# Altium schematic sheet Target.SchDoc: Sniffer
size A4; DocumentNumber: 5; SheetNumber: 5; SheetTotal: 5
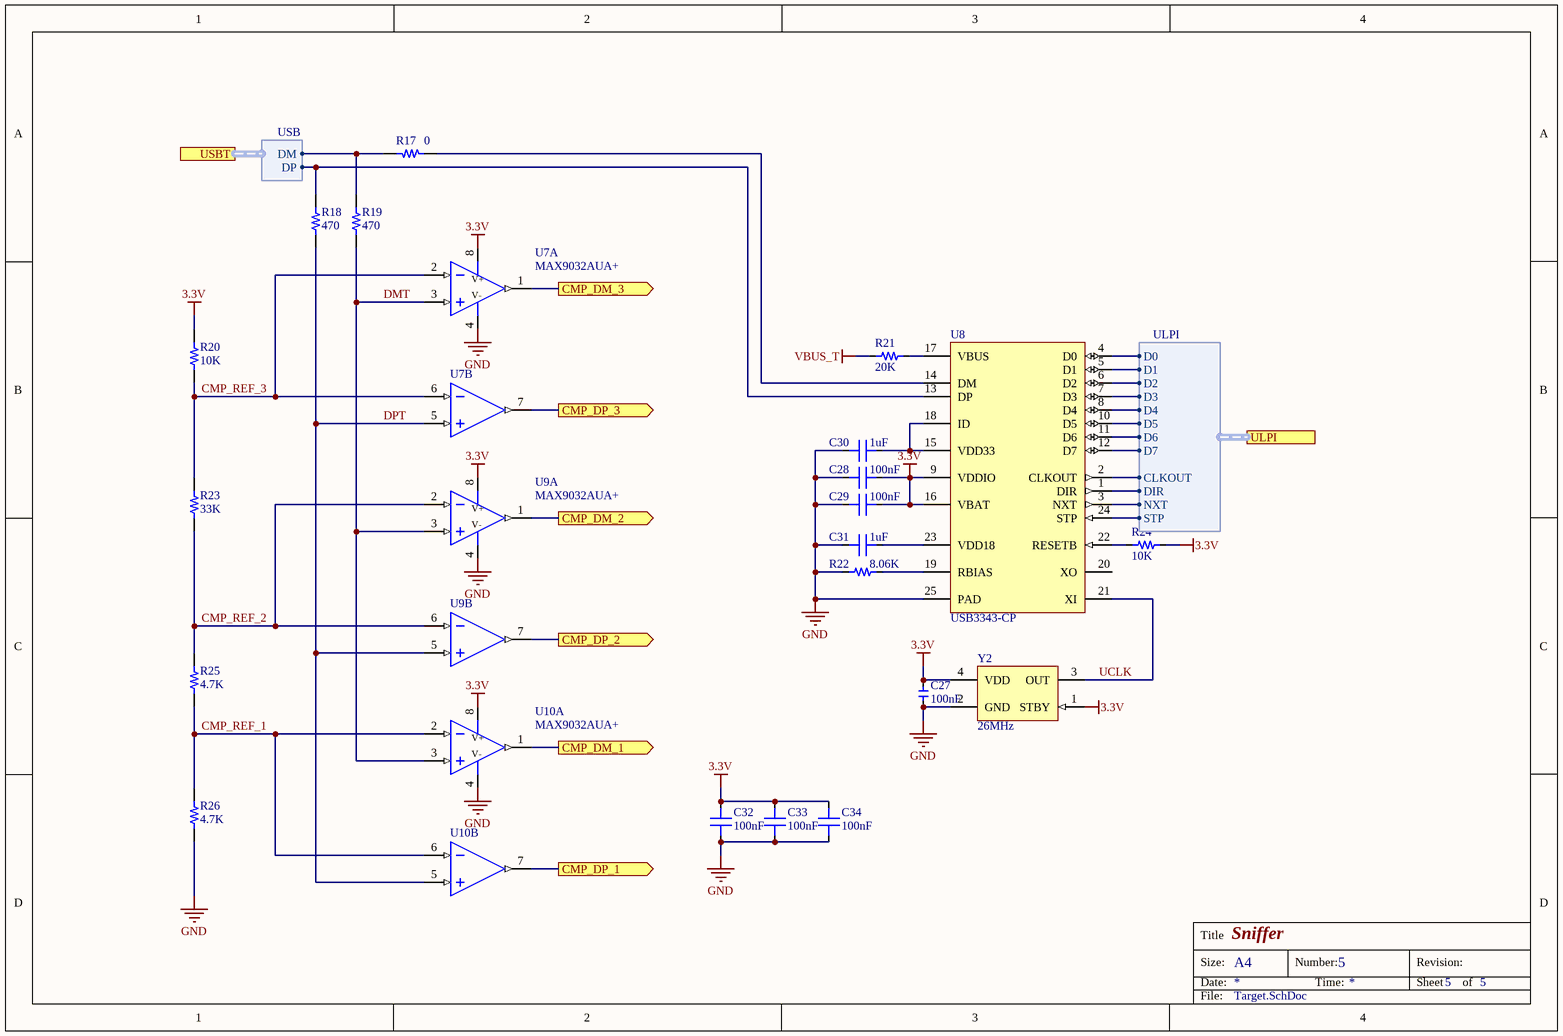
[diagram p0: Target.SchDoc]

## Parts
C27  100nF  [CAP 0402/1005]
C28  100nF  [CAP 0402/1005]
C29  100nF  [CAP 0402/1005]
C30  1uF  [CAP 0402/1005]
C31  1uF  [CAP 0402/1005]
C32  100nF  [CAP 0402/1005]
C33  100nF  [CAP 0402/1005]
C34  100nF  [CAP 0402/1005]
R17  0  [RES 0402/1005]
R18  470  [RES 0402/1005]
R19  470  [RES 0402/1005]
R20  10K  [RES 0402/1005]
R21  20K  [RES 0402/1005]
R22  8.06K  [RES 0402/1005]
R23  33K  [RES 0402/1005]
R24  10K  [RES 0402/1005]
R25  4.7K  [RES 0402/1005]
R26  4.7K  [RES 0402/1005]
U7  MAX9032AUA+  [TSOP65P490X110-8N]  (parts A,B of 2)
U8  USB3343-CP  [QFN50P400X400X80_HS-25N]
U9  MAX9032AUA+  [TSOP65P490X110-8N]  (parts A,B of 2)
U10  MAX9032AUA+  [TSOP65P490X110-8N]  (parts A,B of 2)
Y2  26MHz  [WE-SPXO_IQXO-540]

## Ports
CMP_DM_1 (out), CMP_DM_2 (out), CMP_DM_3 (out), CMP_DP_1 (out), CMP_DP_2 (out), CMP_DP_3 (out), ULPI (harness ULPI), USBT (harness USB)

## Harnesses
USB: DP, DM
ULPI: D0, D1, D2, D3, D4, D5, D6, D7, CLKOUT, DIR, NXT, STP

## Nets
3.3V: C27.1 C28.1 C29.2 C32.1 C33.1 C34.1 R20.2 R24.1 U7.8(V+) U8.9(VDDIO) U8.16(VBAT) U9.8(V+) U10.8(V+) Y2.1(STBY) Y2.4(VDD)
GND: C27.2 C28.2 C29.1 C30.1 C31.1 C32.2 C33.2 C34.2 R22.1 R26.1 U7.4(V-) U8.25(PAD) U9.4(V-) U10.4(V-) Y2.2(GND)
VBUS_T: R21.1
CMP_DM_1: U10.1(OUTA) ; port CMP_DM_1
CMP_DM_2: U9.1(OUTA) ; port CMP_DM_2
CMP_DM_3: U7.1(OUTA) ; port CMP_DM_3
CMP_DP_1: U10.7(OUTB) ; port CMP_DP_1
CMP_DP_2: U9.7(OUTB) ; port CMP_DP_2
CMP_DP_3: U7.7(OUTB) ; port CMP_DP_3
CMP_REF_1: R25.1 R26.2 U10.2(-INA) U10.6(-INB)
CMP_REF_2: R23.1 R25.2 U9.2(-INA) U9.6(-INB)
CMP_REF_3: R20.1 R23.2 U7.2(-INA) U7.6(-INB)
DMT: R19.1 U7.3(+INA) U9.3(+INA) U10.3(+INA)
DPT: R18.1 U7.5(+INB) U9.5(+INB) U10.5(+INB)
UCLK: U8.21(XI) Y2.3(OUT)
NetC30_2: C30.2 U8.15(VDD33) U8.18(ID)
NetC31_2: C31.2 U8.23(VDD18)
NetR17_1: R17.1 U8.14(DM)
NetR17_2: R17.2 R19.2 ; port USBT.DM
NetR18_2: R18.2 U8.13(DP) ; port USBT.DP
NetR21_2: R21.2 U8.17(VBUS)
NetR22_2: R22.2 U8.19(RBIAS)
NetR24_2: R24.2 U8.22(RESETB)
NetU8_1: U8.1(DIR) ; port ULPI.DIR
NetU8_2: U8.2(CLKOUT) ; port ULPI.CLKOUT
NetU8_3: U8.3(NXT) ; port ULPI.NXT
NetU8_4: U8.4(D0) ; port ULPI.D0
NetU8_5: U8.5(D1) ; port ULPI.D1
NetU8_6: U8.6(D2) ; port ULPI.D2
NetU8_7: U8.7(D3) ; port ULPI.D3
NetU8_8: U8.8(D4) ; port ULPI.D4
NetU8_10: U8.10(D5) ; port ULPI.D5
NetU8_11: U8.11(D6) ; port ULPI.D6
NetU8_12: U8.12(D7) ; port ULPI.D7
NetU8_24: U8.24(STP) ; port ULPI.STP

Not connected (* = marked no-connect by the designer): U8 20(XO)

## Notes on the sheet
- Title
- Size:
- Date:
- A4
- Number:
- Time:
- Revision:
- Sheet
- of
- File:

## Library data of the parts
C27-C29 C32-C34 = CM0464: CAP CER 100NF 25V X5R 0402; Part Number: GRM155R61E104KA87D; Manufacturer: Murata; TemperatureRange: -55C ~ 85C; Tolerance: 10%; Value: 100nF; PartId: CM0464; Supplier 1: Digi-Key; Supplier Part Number 1: 490-5920-2-ND; ComponentLink1Description: Datasheet; ComponentLink1URL: http://www.murata.com/~/media/webrenewal/support/library/catalog/products/capacitor/mlcc/c02e.pdf; ComponentLink2Description: Digi-Key Listing; ComponentLink2URL: https://www.digikey.com/product-detail/en/murata-electronics-north-america/GRM155R61E104KA87D/490-5920-2-ND/3693681; TemperatureCoefficient: X5R; Voltage: 25V; Price: 0.0048; Device Package: 0402 (1005 Metric)
C30 C31 = CM0490: CAP CER 1UF 6.3V X5R 0402; Part Number: GRM155R60J105KE19D; Manufacturer: Murata; TemperatureRange: -55C ~ 85C; Tolerance: 10%; Value: 1uF; PartId: CM0490; Supplier 1: Digi-Key; Supplier Part Number 1: 490-1320-2-ND; ComponentLink1Description: Datasheet; ComponentLink1URL: http://www.murata.com/~/media/webrenewal/support/library/catalog/products/capacitor/mlcc/c02e.pdf; ComponentLink2Description: Digi-Key Listing; ComponentLink2URL: https://www.digikey.com/product-detail/en/murata-electronics-north-america/GRM155R60J105KE19D/490-1320-2-ND/587208; TemperatureCoefficient: X5R; Voltage: 6.3V; Price: 0.006; Device Package: 0402 (1005 Metric)
R17 = RC0971: RES SMD 0 OHM 5% 1/16W 0402; Part Number: RC0402JR-070RL; Manufacturer: Yageo; TemperatureRange: -55C ~ 155C; TemperatureCoefficient: 100ppm/C; PowerRating: 0.0625W, 1/16W; PartId: RC0971; Value: 0; Supplier 1: Mouser; Supplier Part Number 1: 603-RC0402JR-070RL; ComponentLink1Description: Datasheet; ComponentLink1URL: http://www.yageo.com/NewPortal/yageodocoutput?fileName=/pdf/R-Chip/PYu-RC_Group_51_RoHS_L_9.pdf; Tolerance: 5%; Price: 0.0043; Type: Thick Film; Device Package: 0402 (1005 Metric)
R18 R19 = RC1342: RES SMD 470 OHM 1% 1/16W 0402; Part Number: RC0402FR-07470RL; Manufacturer: Yageo; TemperatureRange: -55C ~ 155C; TemperatureCoefficient: 100ppm/C; PowerRating: 0.0625W, 1/16W; PartId: RC1342; Value: 470; Supplier 1: Mouser; Supplier Part Number 1: 603-RC0402FR-07470RL; ComponentLink1Description: Datasheet; ComponentLink1URL: http://www.yageo.com/NewPortal/yageodocoutput?fileName=/pdf/R-Chip/PYu-RC_Group_51_RoHS_L_9.pdf; Tolerance: 1%; Price: 0.0043; Type: Thick Film; Device Package: 0402 (1005 Metric)
R20 R24 = RC1531: RES SMD 10K OHM 1% 1/16W 0402; Part Number: RC0402FR-0710KL; Manufacturer: Yageo; TemperatureRange: -55C ~ 155C; TemperatureCoefficient: 100ppm/C; PowerRating: 0.0625W, 1/16W; PartId: RC1531; Value: 10K; Supplier 1: Mouser; Supplier Part Number 1: 603-RC0402FR-0710KL; ComponentLink1Description: Datasheet; ComponentLink1URL: http://www.yageo.com/NewPortal/yageodocoutput?fileName=/pdf/R-Chip/PYu-RC_Group_51_RoHS_L_9.pdf; Tolerance: 1%; Price: 0.0043; Type: Thick Film; Device Package: 0402 (1005 Metric)
R21 = RC1570: RES SMD 20K OHM 1% 1/16W 0402; Part Number: RC0402FR-0720KL; Manufacturer: Yageo; TemperatureRange: -55C ~ 155C; TemperatureCoefficient: 100ppm/C; PowerRating: 0.0625W, 1/16W; PartId: RC1570; Value: 20K; Supplier 1: Mouser; Supplier Part Number 1: 603-RC0402FR-0720KL; ComponentLink1Description: Datasheet; ComponentLink1URL: http://www.yageo.com/NewPortal/yageodocoutput?fileName=/pdf/R-Chip/PYu-RC_Group_51_RoHS_L_9.pdf; Tolerance: 1%; Price: 0.0043; Type: Thick Film; Device Package: 0402 (1005 Metric)
R22 = RC1517: RES SMD 8.06K OHM 1% 1/16W 0402; Part Number: RC0402FR-078K06L; Manufacturer: Yageo; TemperatureRange: -55C ~ 155C; TemperatureCoefficient: 100ppm/C; PowerRating: 0.0625W, 1/16W; PartId: RC1517; Value: 8.06K; Supplier 1: Mouser; Supplier Part Number 1: 603-RC0402FR-078K06L; ComponentLink1Description: Datasheet; ComponentLink1URL: http://www.yageo.com/NewPortal/yageodocoutput?fileName=/pdf/R-Chip/PYu-RC_Group_51_RoHS_L_9.pdf; Tolerance: 1%; Price: 0.0043; Type: Thick Film; Device Package: 0402 (1005 Metric)
R23 = RC1600: RES SMD 33K OHM 1% 1/16W 0402; Part Number: RC0402FR-0733KL; Manufacturer: Yageo; TemperatureRange: -55C ~ 155C; TemperatureCoefficient: 100ppm/C; PowerRating: 0.0625W, 1/16W; PartId: RC1600; Value: 33K; Supplier 1: Mouser; Supplier Part Number 1: 603-RC0402FR-0733KL; ComponentLink1Description: Datasheet; ComponentLink1URL: http://www.yageo.com/NewPortal/yageodocoutput?fileName=/pdf/R-Chip/PYu-RC_Group_51_RoHS_L_9.pdf; Tolerance: 1%; Price: 0.0043; Type: Thick Film; Device Package: 0402 (1005 Metric)
R25 R26 = RC1484: RES SMD 4.7K OHM 1% 1/16W 0402; Part Number: RC0402FR-074K7L; Manufacturer: Yageo; TemperatureRange: -55C ~ 155C; TemperatureCoefficient: 100ppm/C; PowerRating: 0.0625W, 1/16W; PartId: RC1484; Value: 4.7K; Supplier 1: Mouser; Supplier Part Number 1: 603-RC0402FR-074K7L; ComponentLink1Description: Datasheet; ComponentLink1URL: http://www.yageo.com/NewPortal/yageodocoutput?fileName=/pdf/R-Chip/PYu-RC_Group_51_RoHS_L_9.pdf; Tolerance: 1%; Price: 0.0043; Type: Thick Film; Device Package: 0402 (1005 Metric)
U7 U9 U10 = UC0019: IC COMP PP TSSOP-8; Manufacturer: AD; PartId: UC0019; Part Number: MAX9032AUA+; Supplier 1: Digi-Key; Supplier Part Number 1: MAX9032AUA+-ND; Supplier 2: Mouser; Supplier Part Number 2: 700-MAX9032AUA; ComponentLink1Description: Datasheet; ComponentLink1URL: https://www.analog.com/media/en/technical-documentation/data-sheets/MAX9030-MAX9034.pdf; Price: 0.7; Type: Comparator; Device Package: TSSOP-8; Operating Temperature: -40C ~ 125C
U8 = IIF028: USB ULPI PHY 24QFN; Manufacturer: Microchip; PartId: IIF028; Part Number: USB3343-CP; Supplier 1: Digi-Key; Supplier Part Number 1: USB3343-CP-ND; Supplier 2: Mouser; Supplier Part Number 2: 579-USB3343-CP; ComponentLink1Description: Datasheet; ComponentLink1URL: https://ww1.microchip.com/downloads/en/DeviceDoc/USB334x-Data-Sheet-DS00002646A.pdf; Price: 1.8; Type: USB ULPI Phy; Device Package: 24-QFN (4x4); Operating Temperature: -40C ~ 85C
Y2 = OX0070: OSC XO 26MHz 3.3V 2016 SMD; Part Number: 831056245; Manufacturer: Wurth; Frequency Stability: 50ppm; Load Capacitance: 15pF; PartId: OX0070; Value: 26MHz; Supplier 1: Mouser; Supplier Part Number 1: 710-831056245; ComponentLink1Description: Datasheet; ComponentLink1URL: https://www.we-online.com/redexpert/spec/831056245?ad; Price: 0.4; Type: XO (Standard); Device Package: 4-SMD, 2016; Series: IQXO-540; Frequency: 26MHz; Supply Voltage: 3.3V